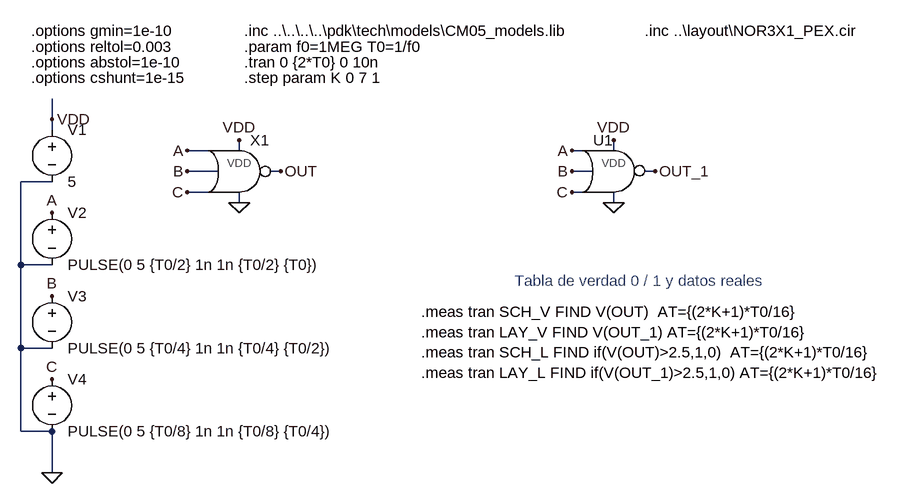
[diagram p0: schematic NOR3X1_sch_tb.asc]
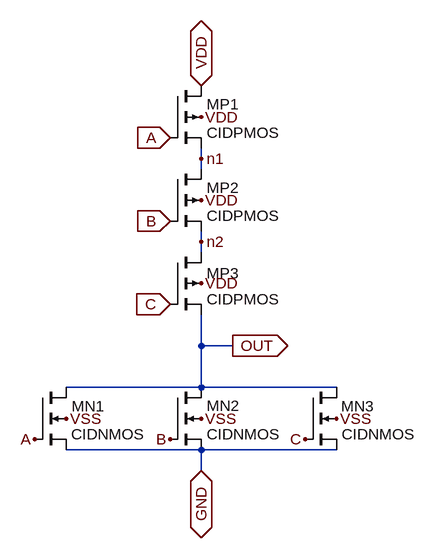
[diagram p1: sub-circuit nor3x1_sch.asc]
NOR3X1_sch_tb.asc, the LTspice schematic file:
Version 4.1
SHEET 1 1636 1028
WIRE -320 -112 -320 -144
WIRE -320 -96 -320 -112
WIRE -80 -64 -112 -64
WIRE -32 -64 -32 -80
WIRE 496 -64 480 -64
WIRE 544 -64 544 -80
WIRE -64 -32 -112 -32
WIRE 32 -32 16 -32
WIRE 512 -32 480 -32
WIRE 608 -32 592 -32
WIRE -320 -16 -368 -16
WIRE -80 0 -112 0
WIRE 496 0 480 0
WIRE -32 16 -32 0
WIRE 544 16 544 0
WIRE -368 112 -368 -16
WIRE -320 112 -368 112
WIRE -368 240 -368 112
WIRE -320 240 -368 240
WIRE -368 368 -368 240
WIRE -320 368 -368 368
WIRE -320 432 -320 368
FLAG -112 -64 A
FLAG -112 -32 B
FLAG -112 0 C
FLAG 32 -32 OUT
FLAG -32 -80 VDD
FLAG -320 432 0
FLAG -320 -112 VDD
FLAG -320 32 A
FLAG -320 160 B
FLAG -320 288 C
FLAG 544 -80 VDD
FLAG 608 -32 OUT_1
FLAG 480 -64 A
FLAG 480 -32 B
FLAG 480 0 C
FLAG 544 16 0
FLAG -32 16 0
SYMBOL voltage -320 -112 R0
SYMATTR InstName V1
SYMATTR Value 5
SYMBOL voltage -320 16 R0
SYMATTR InstName V2
SYMATTR Value PULSE(0 5 {T0/2} 1n 1n {T0/2} {T0})
SYMBOL voltage -320 144 R0
SYMATTR InstName V3
SYMATTR Value PULSE(0 5 {T0/4} 1n 1n {T0/4} {T0/2})
SYMBOL voltage -320 272 R0
SYMATTR InstName V4
SYMATTR Value PULSE(0 5 {T0/8} 1n 1n {T0/8} {T0/4})
SYMBOL NOR3X1_lay_PEX 560 -32 R0
SYMATTR InstName U1
SYMBOL NOR3X1_sch -32 -16 R0
WINDOW 0 32 -48 Bottom 2
SYMATTR InstName X1
TEXT -352 -248 Left 2 !.options gmin=1e-10
TEXT -352 -200 Left 2 !.options abstol=1e-10
TEXT -352 -224 Left 2 !.options reltol=0.003
TEXT -352 -176 Left 2 !.options cshunt=1e-15
TEXT -24 -248 Left 2 !.inc ..\\..\\..\\..\\pdk\\tech\\models\\CM05_models.lib
TEXT -24 -224 Left 2 !.param f0=1MEG T0=1/f0
TEXT -24 -200 Left 2 !.tran 0 {2*T0} 0 10n
TEXT -24 -176 Left 2 !.step param K 0 7 1
TEXT 248 184 Left 2 !.meas tran SCH_V FIND V(OUT)  AT={(2*K+1)*T0/16} \n.meas tran LAY_V FIND V(OUT_1) AT={(2*K+1)*T0/16} \n.meas tran SCH_L FIND if(V(OUT)>2.5,1,0)  AT={(2*K+1)*T0/16} \n.meas tran LAY_L FIND if(V(OUT_1)>2.5,1,0) AT={(2*K+1)*T0/16}
TEXT 392 136 Left 2 ;Tabla de verdad 0 / 1 y datos reales
TEXT 592 -248 Left 2 !.inc ..\\layout\\NOR3X1_PEX.cir

nor3x1_sch.asc, the sub-circuit schematic file:
Version 4.1
SHEET 1 880 764
WIRE 208 128 208 112
WIRE 208 144 208 128
WIRE 208 256 208 240
WIRE 208 272 208 256
WIRE 208 416 208 368
WIRE 256 416 208 416
WIRE 208 480 208 416
WIRE 208 480 0 480
WIRE 416 480 208 480
WIRE 208 576 0 576
WIRE 416 576 208 576
WIRE 208 608 208 576
FLAG 160 96 A
IOPIN 160 96 In
FLAG 160 224 B
IOPIN 160 224 In
FLAG 160 352 C
IOPIN 160 352 In
FLAG 208 16 VDD
IOPIN 208 16 BiDir
FLAG 256 416 OUT
IOPIN 256 416 Out
FLAG 208 608 GND
IOPIN 208 608 BiDir
FLAG -48 560 A
FLAG 160 560 B
FLAG 368 560 C
FLAG 208 320 VDD
FLAG 208 192 VDD
FLAG 208 64 VDD
FLAG 0 528 VSS
FLAG 208 528 VSS
FLAG 416 528 VSS
FLAG 208 128 n1
FLAG 208 256 n2
SYMBOL pmos4 160 16 R0
WINDOW 0 56 28 Left 2
SYMATTR InstName MP1
SYMATTR Value CIDPMOS
SYMATTR Value2 l=5u w=37.5u
SYMBOL pmos4 160 144 R0
WINDOW 0 56 29 Left 2
SYMATTR InstName MP2
SYMATTR Value CIDPMOS
SYMATTR Value2 l=5u w=37.5u
SYMBOL pmos4 160 272 R0
SYMATTR InstName MP3
SYMATTR Value CIDPMOS
SYMATTR Value2 l=5u w=37.5u
SYMBOL nmos4 -48 480 R0
WINDOW 0 57 29 Left 2
SYMATTR InstName MN1
SYMATTR Value CIDNMOS
SYMATTR Value2 l=5u w=10u
SYMBOL nmos4 160 480 R0
WINDOW 0 56 28 Left 2
SYMATTR InstName MN2
SYMATTR Value CIDNMOS
SYMATTR Value2 l=5u w=10u
SYMBOL nmos4 368 480 R0
WINDOW 0 55 29 Left 2
SYMATTR InstName MN3
SYMATTR Value CIDNMOS
SYMATTR Value2 l=5u w=10u

The netlist it stands for:
* NOR3X1_sch_tb.asc
V1 VDD 0 5
V2 A 0 PULSE(0 5 {T0/2} 1n 1n {T0/2} {T0})
V3 B 0 PULSE(0 5 {T0/4} 1n 1n {T0/4} {T0/2})
V4 C 0 PULSE(0 5 {T0/8} 1n 1n {T0/8} {T0/4})
X§U1 A B C VDD OUT_1 0 NOR3X1_PEX  ; pins A B C VDD OUT GND
X§X1 A B C VDD OUT 0 nor3x1_sch

* block symbol definitions
.subckt nor3x1_sch A B C VDD OUT GND
MP1 VDD A n1 VDD CIDPMOS l=5u w=37.5u
MP2 n1 B n2 VDD CIDPMOS l=5u w=37.5u
MP3 n2 C OUT VDD CIDPMOS l=5u w=37.5u
MN1 OUT A GND VSS CIDNMOS l=5u w=10u
MN2 OUT B GND VSS CIDNMOS l=5u w=10u
MN3 OUT C GND VSS CIDNMOS l=5u w=10u
.ends nor3x1_sch

.model NMOS NMOS
.model PMOS PMOS
.lib standard.mos
.options gmin=1e-10
.options abstol=1e-10
.options reltol=0.003
.options cshunt=1e-15
.inc ..\..\..\..\pdk\tech\models\CM05_models.lib
.param f0=1MEG T0=1/f0
.tran 0 {2*T0} 0 10n
.step param K 0 7 1
.meas tran SCH_V FIND V(OUT)  AT={(2*K+1)*T0/16}
.meas tran LAY_V FIND V(OUT_1) AT={(2*K+1)*T0/16}
.meas tran SCH_L FIND if(V(OUT)>2.5,1,0)  AT={(2*K+1)*T0/16}
.meas tran LAY_L FIND if(V(OUT_1)>2.5,1,0) AT={(2*K+1)*T0/16}
* Tabla de verdad 0 / 1 y datos reales
.inc ..\layout\NOR3X1_PEX.cir
.backanno
.end